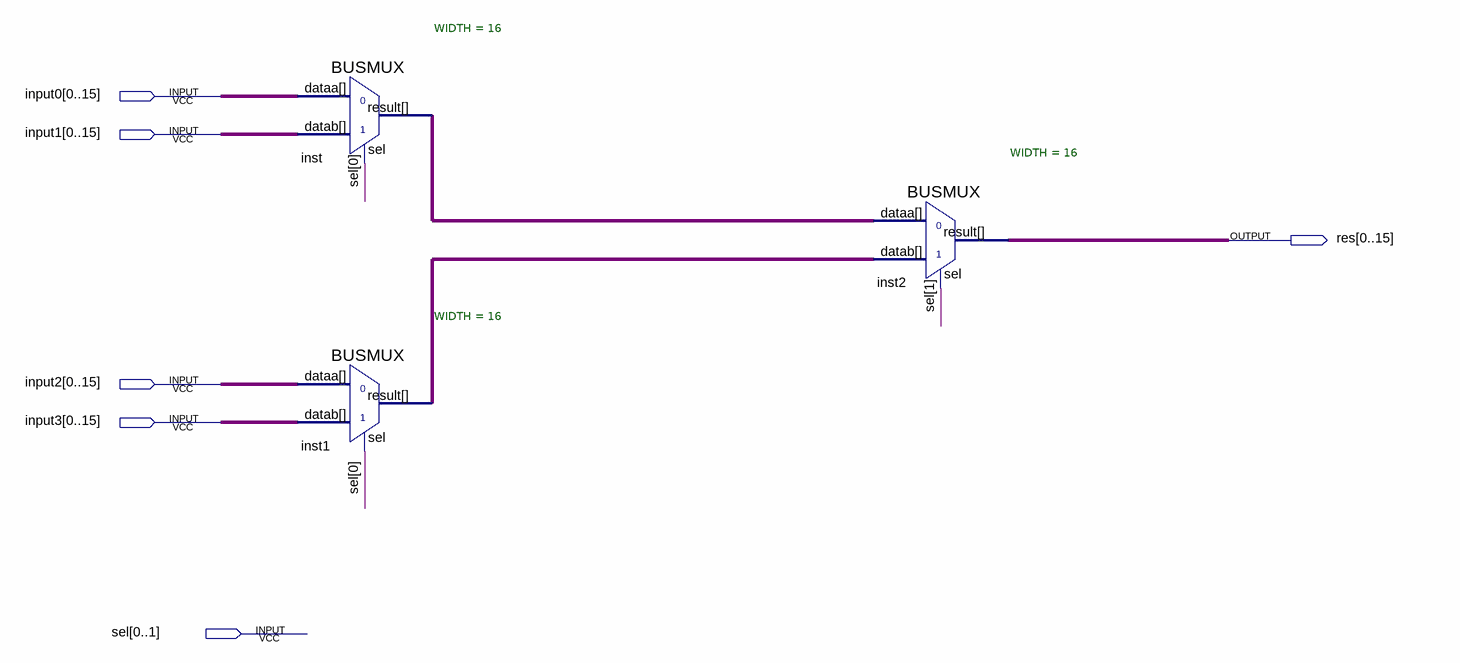
[diagram p0: schematic sheet]
// Quartus schematic mux4to1_16bit.bdf as structural Verilog: 3 symbols, 6 pins
module mux4to1_16bit (
  input  [0:15] input0,
  input  [0:15] input1,
  input  [0:15] input2,
  input  [0:15] input3,
  input  [0:1] sel,
  output [0:15] res
);

  wire [15:0] inst1_result, inst_result;

  BUSMUX #(.WIDTH(16)) inst (.datab(input1), .sel(sel[0]), .dataa(input0), .result(inst_result));
  BUSMUX #(.WIDTH(16)) inst1 (.datab(input3), .sel(sel[0]), .dataa(input2), .result(inst1_result));
  BUSMUX #(.WIDTH(16)) inst2 (.datab(inst1_result), .sel(sel[1]), .dataa(inst_result), .result(res));
endmodule
